# EAGLE design AB_shield (EAGLE 7.6.0)
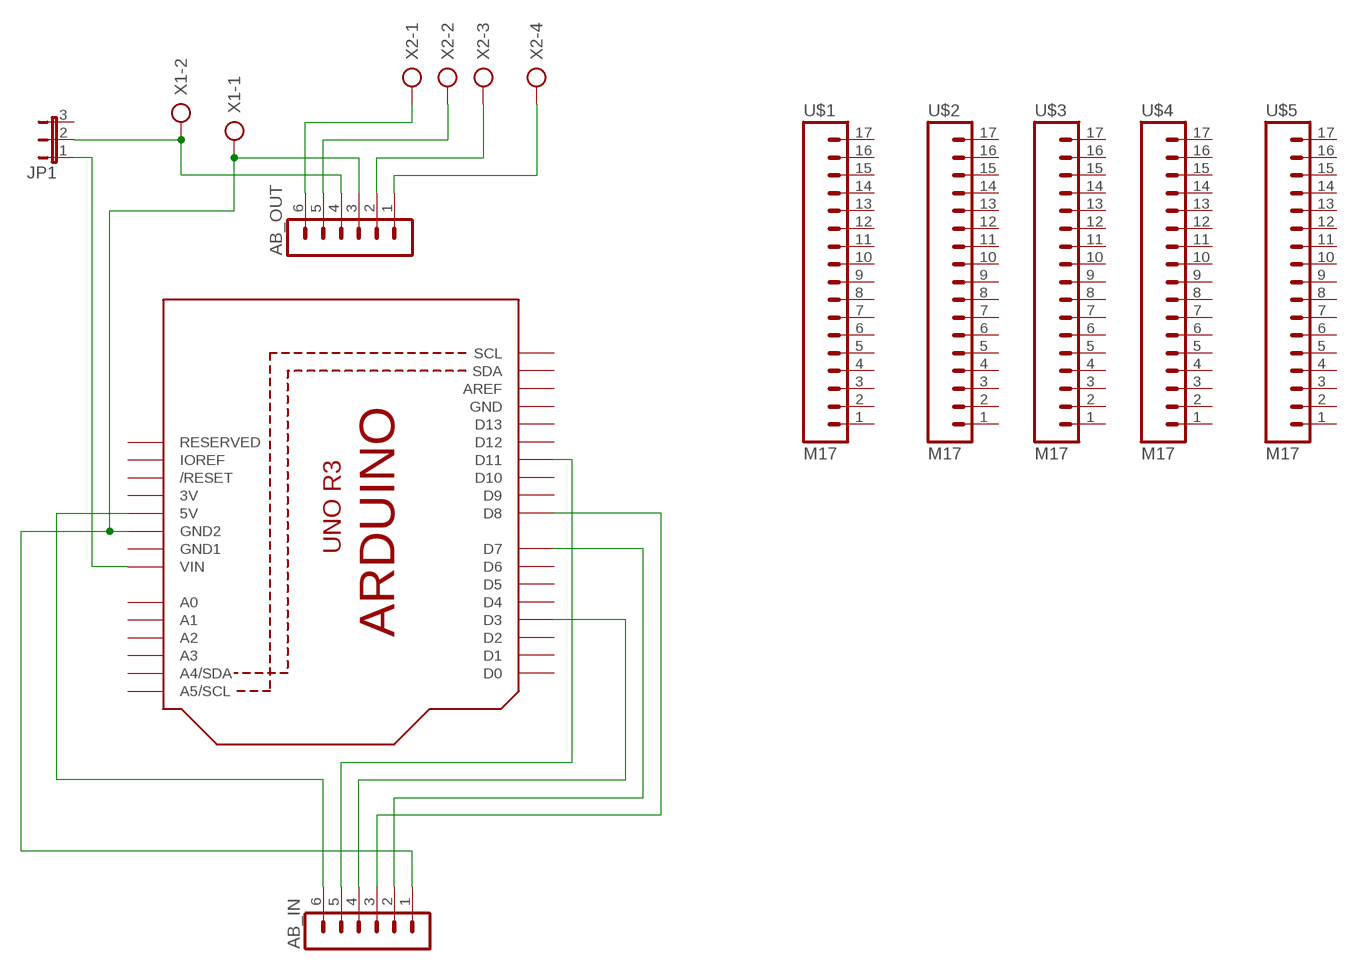
[diagram p0: schematic, sheet 1]

## Parts
AB_IN  MA06-1  [MA06-1]
AB_OUT  MA06-1  [MA06-1]
JP1  JP2E  [JP2]
U1  ARDUINOR3-DIMENSION  [ARDUINOR3]
U$1  M17  [1X17_PROTO]
U$2  M17  [1X17_PROTO]
U$3  M17  [1X17_PROTO]
U$4  M17  [1X17_PROTO]
U$5  M17  [1X17_PROTO]
X1  AK500/2-H  [AK500/2-H]
X2  AK500/4  [AK500/4]

## Nets
N$1: AB_IN.4 U1.D3
N$2: AB_IN.5 U1.D11
N$3: AB_IN.3 U1.D8
N$4: AB_IN.2 U1.D7
N$5: AB_IN.6 U1.5V
N$7: AB_OUT.5 X2.2
N$8: AB_OUT.6 X2.1
N$9: AB_OUT.2 X2.3
N$10: AB_OUT.1 X2.4
N$11: AB_OUT.4 JP1.2 X1.2
N$12: AB_IN.1 AB_OUT.3 U1.GND2 X1.1
N$14: JP1.1 U1.VIN
Unconnected: JP1.3 U1.A0 U1.A1 U1.A2 U1.A3 U1.A4(A4/SDA) U1.A5(A5/SCL) U1.AREF U1.D0 U1.D1 U1.D2 U1.D4 U1.D5 U1.D6 U1.D9 U1.D10 U1.D12 U1.D13 U1.IOREF U1.RESERVED U1.RESET(/RESET) U1.SCL U1.SDA U$1.1 U$1.2 U$1.3 U$1.4 U$1.5 U$1.6 U$1.7 U$1.8 U$1.9 U$1.10 U$1.11 U$1.12 U$1.13 U$1.14 U$1.15 U$1.16 U$1.17 U$2.1 U$2.2 U$2.3 U$2.4 U$2.5 U$2.6 U$2.7 U$2.8 U$2.9 U$2.10 U$2.11 U$2.12 U$2.13 U$2.14 U$2.15 U$2.16 U$2.17 U$3.1 U$3.2 U$3.3 U$3.4 U$3.5 U$3.6 U$3.7 U$3.8 U$3.9 U$3.10 U$3.11 U$3.12 U$3.13 U$3.14 U$3.15 U$3.16 U$3.17 U$4.1 U$4.2 U$4.3 U$4.4 U$4.5 U$4.6 U$4.7 U$4.8 U$4.9 U$4.10 U$4.11 U$4.12 U$4.13 U$4.14 U$4.15 U$4.16 U$4.17 U$5.1 U$5.2 U$5.3 U$5.4 U$5.5 U$5.6 U$5.7 U$5.8 U$5.9 U$5.10 U$5.11 U$5.12 U$5.13 U$5.14 U$5.15 U$5.16 U$5.17

## Power pins joined to a net without a drawn wire
3V: U1.3V
GND: U1.GND
GND1: U1.GND1

## Library data of the parts
AB_IN AB_OUT = con-lstb:MA06-1: PIN HEADER; OC_FARNELL: unknown; OC_NEWARK: unknown
JP1 = jumper:JP2E: JUMPER
U1 = adafruit:ARDUINOR3: This is a new object for the new Arduino R3 - with extra pins that you may want to use (such as IOref, and duplicated A4/A5
U$1-U$5 = SparkFun_proto:M17
X1 = con-ptr500:AK500/2-H: CONNECTOR Aug. 2004 / PTR Meßtechnik: Die Bezeichnung der Serie AK505 wurde geändert. Es handelt sich hierbei um AK500 in horizontaler Ausführung.; OC_FARNELL: unknown; OC_NEWARK: unknown
X2 = con-ptr500:AK500/4: CONNECTOR; OC_FARNELL: unknown; OC_NEWARK: unknown

## Board
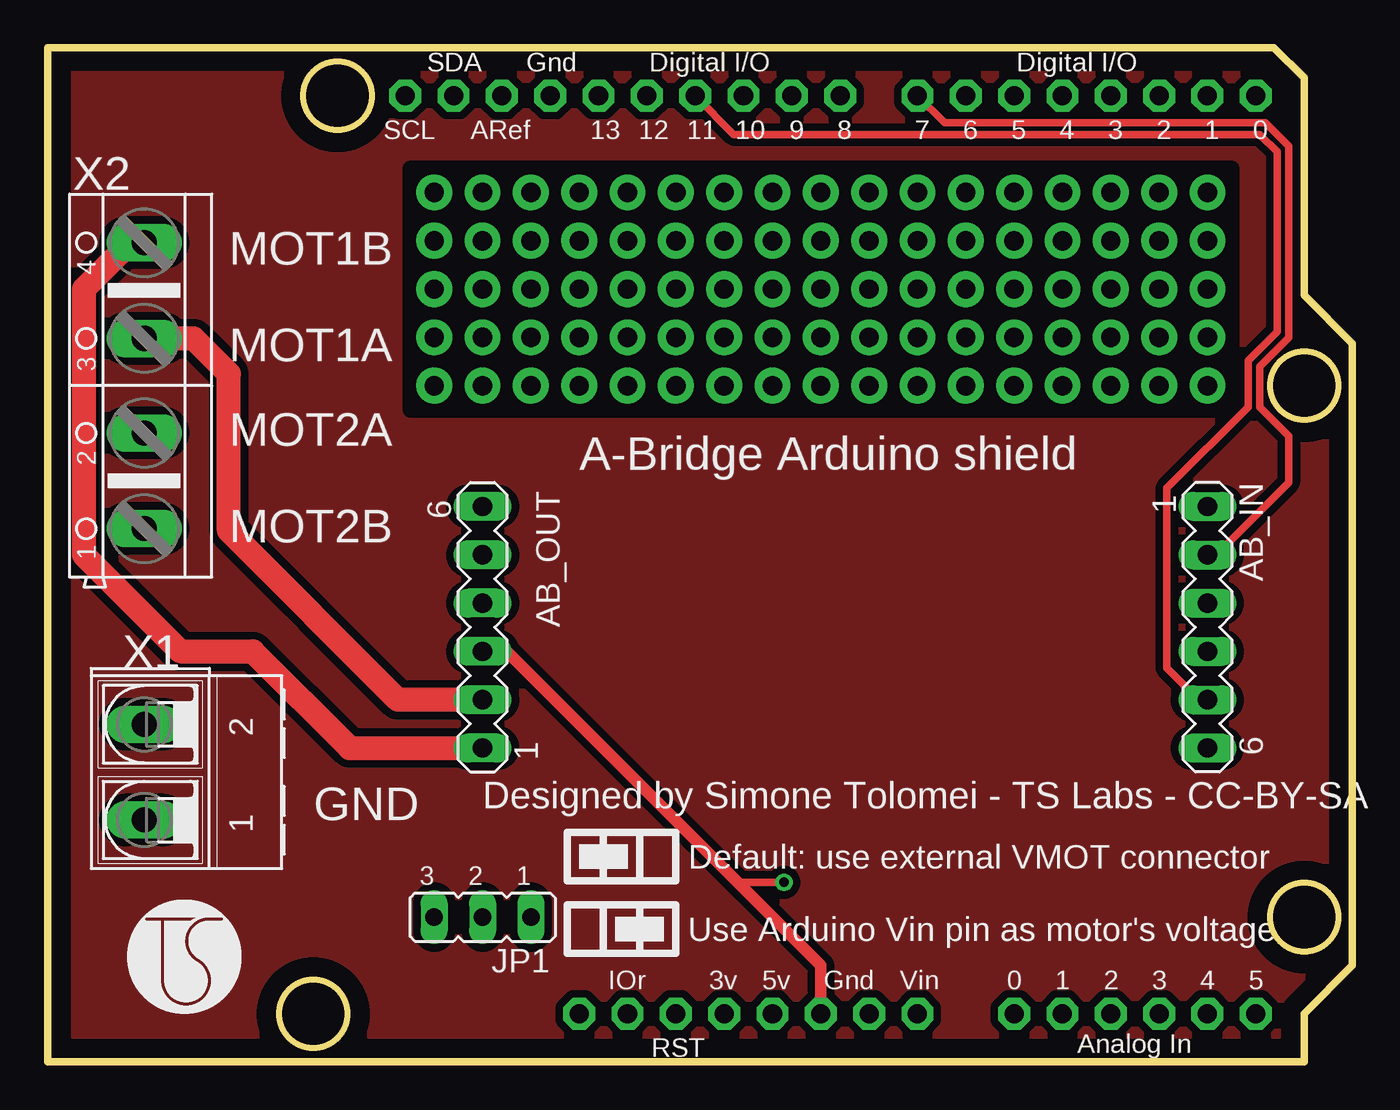
[diagram p1: board, top side]
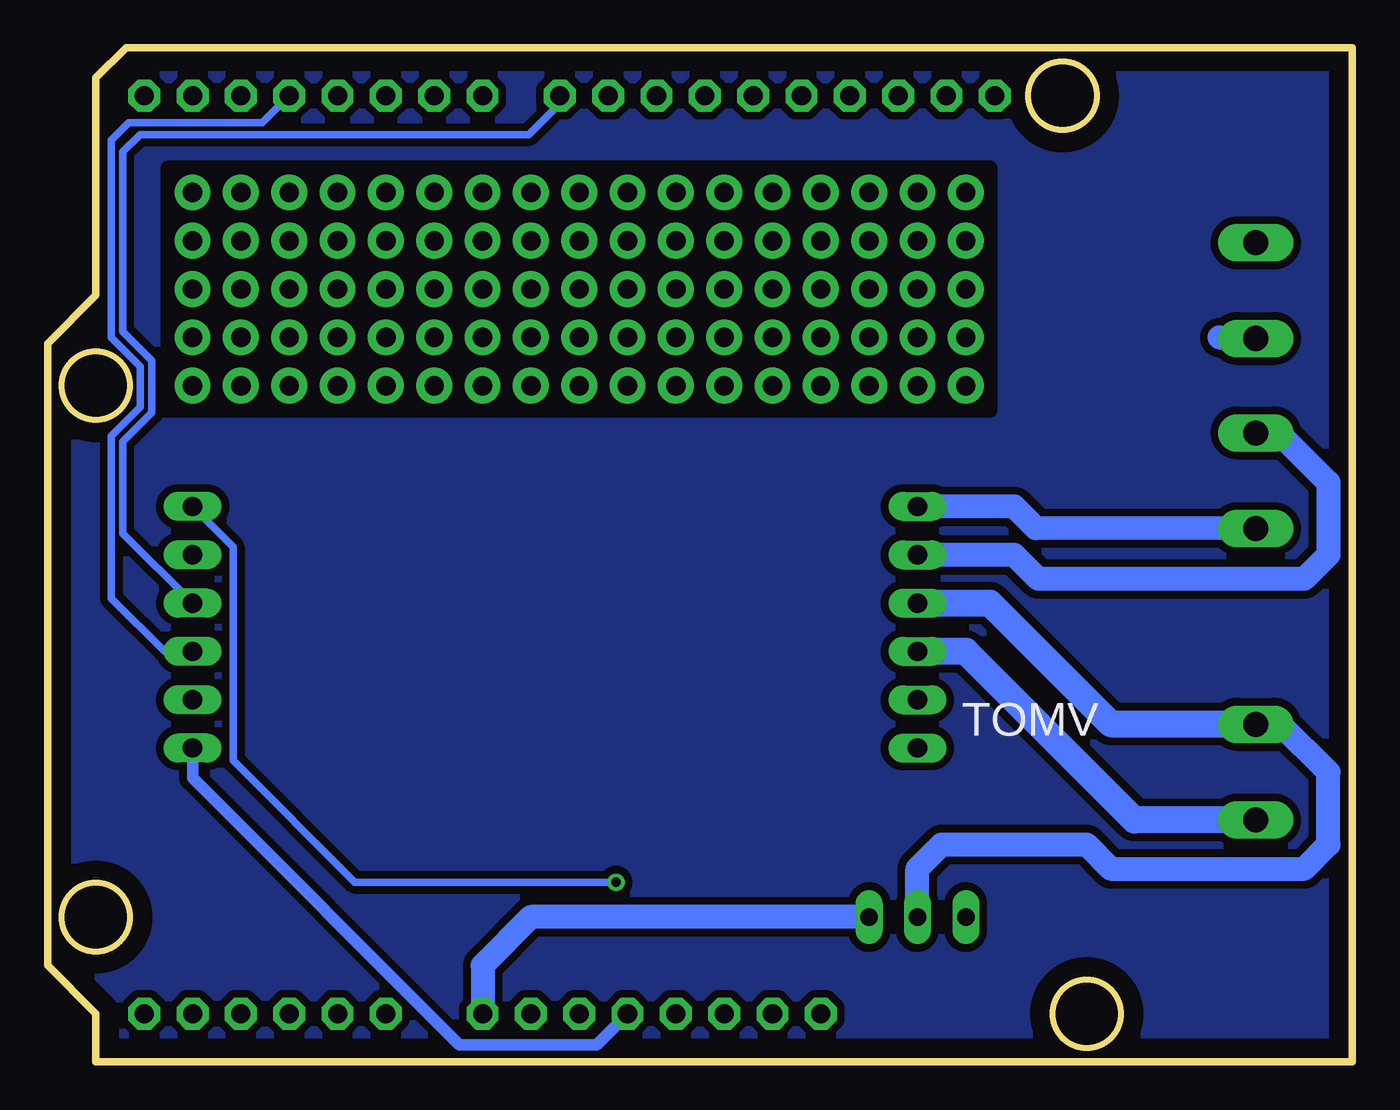
[diagram p2: board, bottom side, seen from below]

Size 68.58 x 53.34 mm. Coordinates in mm from the lower left corner, seen from the top.
Outline: 0,0 66.04,0 66.04,2.54 68.58,5.08 68.58,37.78 66.04,40.32 66.04,51.75 64.45,53.34 0,53.34 0,0
Outline: circle at 13.97,2.54 radius 1.8
Outline: circle at 66.04,7.62 radius 1.8
Outline: circle at 66.04,35.56 radius 1.8
Outline: circle at 15.24,50.8 radius 1.8
Copper layers (1*16): Top 0.035mm / dielectric 1.5mm / Bottom 0.035mm
Design rules "default": minimum track width 10mil, minimum drill 24mil, track to track 8mil, track to pad 8mil, pad to pad 8mil, via to via 8mil, smd to smd 8mil, copper to edge 40mil, drill to drill 8mil, minimum pad ring 10mil, minimum via ring 8mil, stop-mask expansion 4mil, vias tented up to drill 0mil, thermal gap 10mil
tRestrict: area 13.1,1.6 to 14.9,3.4; area 65.1,6.7 to 66.9,8.5; area 65.1,34.7 to 66.9,36.5; area 14.3,49.9 to 16.1,51.7; area 19.1,34.3 to 62.2,47
bRestrict: area 13.1,1.6 to 14.9,3.4; area 65.1,6.7 to 66.9,8.5; area 65.1,34.7 to 66.9,36.5; area 14.3,49.9 to 16.1,51.7; area 19.1,34.3 to 62.2,47

### Footprints (pad centres in the part's own frame; a part is rotated, then mirrored left to right if it is on the bottom)
MA06-1 = drill 1.016 long: 1 -6.35,0; 2 -3.81,0; 3 -1.27,0; 4 1.27,0; 5 3.81,0; 6 6.35,0
JP2 = drill 0.914 long: 1 -2.54,0; 2 0,0; 3 2.54,0
ARDUINOR3 = drill 1 pad 1.676 octagon: 3V 35.56,2.54; 5V 38.1,2.54; A0 50.8,2.54; A1 53.34,2.54; A2 55.88,2.54; A3 58.42,2.54; A4 60.96,2.54; A5 63.5,2.54; AREF 23.876,50.8; D0 63.5,50.8; D1 60.96,50.8; D2 58.42,50.8; D3 55.88,50.8; D4 53.34,50.8; D5 50.8,50.8; D6 48.26,50.8; D7 45.72,50.8; D8 41.656,50.8; D9 39.116,50.8; D10 36.576,50.8; D11 34.036,50.8; D12 31.496,50.8; D13 28.956,50.8; GND 26.416,50.8; GND1 43.18,2.54; GND2 40.64,2.54; IOREF 30.48,2.54; RESERVED 27.94,2.54; RESET 33.02,2.54; SCL 18.796,50.8; SDA 21.336,50.8; VIN 45.72,2.54
1X17_PROTO = drill 1.016 pad 1.88: 1 0,0; 2 2.54,0; 3 5.08,0; 4 7.62,0; 5 10.16,0; 6 12.7,0; 7 15.24,0; 8 17.78,0; 9 20.32,0; 10 22.86,0; 11 25.4,0; 12 27.94,0; 13 30.48,0; 14 33.02,0; 15 35.56,0; 16 38.1,0; 17 40.64,0
AK500/2-H = drill 1.321 long: 1 -2.515,0; 2 2.515,0
AK500/4 = drill 1.321 long: 1 -7.518,0; 2 -2.489,0; 3 2.489,0; 4 7.518,0

### Placement (x,y rotation side)
AB_IN  60.96,22.86 270 top
AB_OUT  22.86,22.86 90 top
JP1  22.86,7.62 180 top
U1  0,0 0 top
U$1  20.32,45.72 0 top
U$2  20.32,43.18 0 top
U$3  20.32,40.64 0 top
U$4  20.32,38.1 0 top
U$5  20.32,35.56 0 top
X1  5.08,15.24 90 top
X2  5.08,35.56 90 top

### Tracks (layer width: path | path; a pad name or v marks a point on that pad's centre or on a via)
N$1
  Bottom 0.406: U1.D3 57.3,49.38 64.31,49.38 65.23,48.46 65.23,38.1 63.7,36.58 63.7,34.44 65.23,32.92 65.23,24.38 62.43,21.59 AB_IN.4
N$2
  Top 0.406: U1.D11 36.07,48.77 63.7,48.77 64.62,47.85 64.62,38.41 63.09,36.88 63.09,34.44 58.83,30.18 58.83,20.73 60.5,19.05 AB_IN.5
N$3
  Bottom 0.406: AB_IN.3 64.62,27.79 64.62,32.61 63.09,34.14 63.09,36.88 64.62,38.41 64.62,47.85 63.7,48.77 43.28,48.77 41.66,50.39 U1.D8
N$4
  Top 0.406: U1.D7 47.14,49.38 64.01,49.38 65.23,48.16 65.23,38.1 63.7,36.58 63.7,34.44 65.23,32.92 65.23,30.48 61.42,26.67 AB_IN.2
N$5
  Bottom 0.61: U1.5V 39.73,0.91 46.94,0.91 60.96,14.94 AB_IN.6
N$6
  pour Top (isolate 0.406): 0,0 66.04,0 66.04,2.54 68.58,5.08 68.58,37.47 66.04,40.01 66.04,51.44 64.14,53.34 0,53.34
N$7
  Bottom 1.27: X2.2 3.83,33.05 1.27,30.48 1.27,26.67 2.54,25.4 16.51,25.4 17.78,26.67 AB_OUT.5
N$8
  Bottom 1.27: X2.1 16.64,28.07 17.78,29.21 AB_OUT.6
N$9
  Top 1.27: AB_OUT.2 18.41,19.05 9.53,27.94 9.53,36.2 7.67,38.05 X2.3
  Bottom 1.27: 6.99,38.1 5.11,38.1 X2.3
N$10
  Top 1.27: X2.4 4.34,43.08 1.91,40.64 1.91,26.67 6.99,21.59 10.79,21.59 15.88,16.51 AB_OUT.1 23.5,16.51
  Bottom 1.27: 5.21,43.18 X2.4
N$11
  Bottom 1.27: JP1.2 22.86,10.16 21.59,11.43 13.97,11.43 12.7,10.16 2.54,10.16 1.27,11.43 1.27,15.24 3.81,17.78 5.03,17.78 X1.2
  Bottom 1.422: AB_OUT.4 19.05,24.13 12.7,17.78 5.13,17.78 X1.2
N$12  (via drill 0.5)
  Top 0.406: v38.71,9.45 36.27,9.45
  Top 0.61: AB_OUT.3 24.13,21.59 36.27,9.45 40.64,5.08 U1.GND2
  Bottom 0.406: AB_IN.1 58.83,27.08 58.83,15.85 52.43,9.45 v38.71,9.45
  Bottom 1.422: X1.1 11.46,12.72 20.32,21.59 AB_OUT.3
N$13
  pour Bottom (isolate 0.406): 0,0 66.04,0 66.04,2.54 68.58,5.08 68.58,37.47 66.04,40.01 66.04,51.44 64.14,53.34 0,53.34
N$14
  Bottom 1.27: JP1.1 43.18,7.62 45.72,5.08 U1.VIN

### Text on the board
tPlace: MOT1B | MOT1A | MOT2A | A-Bridge Arduino shield | MOT2B | GND | Designed by Simone Tolomei - TS Labs - CC-BY-SA | Default: use external VMOT connector | Use Arduino Vin pin as motor's voltage | C:/Users/Simone/Documents/TSLabs/LOGO/logo_BTMAP_BW.bmp
bPlace: VMOT